# EAGLE design untitled-1.1 (EAGLE 9.6.2)
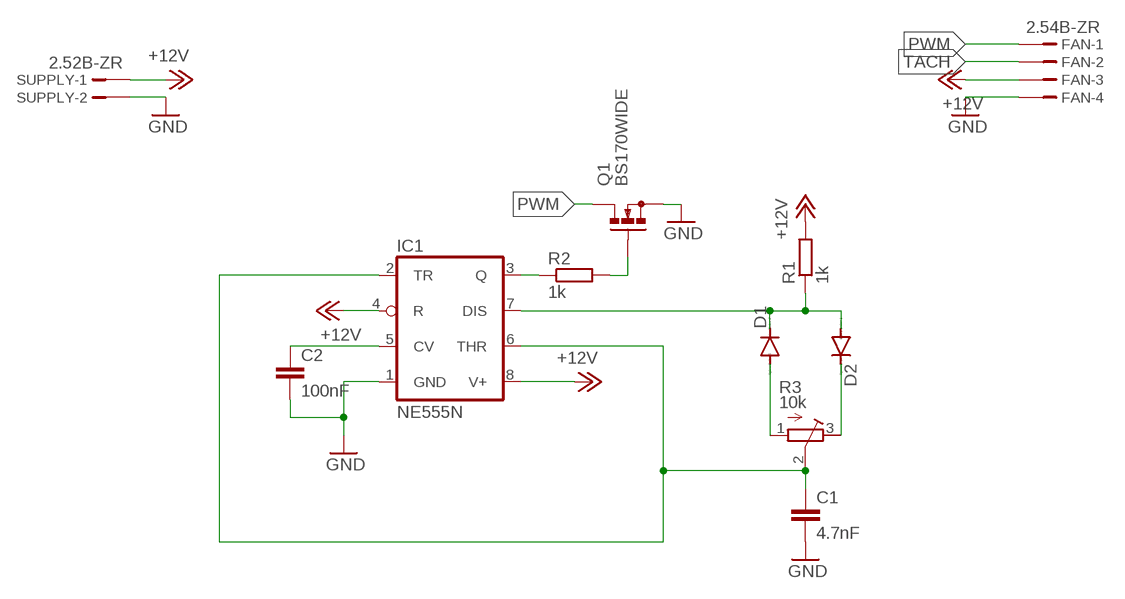
[diagram p0: schematic, sheet 1]

## Parts
C1  4.7nF  C-EU050-030X075  [C050-030X075]
C2  100nF  C-EU025-025X050  [C025-025X050]
D1  1N40045  [DO41-5]
D2  1N40045  [DO41-5]
FAN  2.54B-ZR  [B4B-ZR2.5]
IC1  NE555N  [DIL08]
Q1  BS170WIDE  [SOT54E2]
R1  1k  R-EU_0204/7  [0204/7]
R2  1k  R-EU_0204/7  [0204/7]
R3  10k  R-TRIMM3296W  [RTRIM3296W]
SUPPLY  2.52B-ZR  [B2B-ZR2.5]

## Nets
+12V: FAN.3 IC1.4(R) IC1.8(V+) R1.2 SUPPLY.1
CV: C2.1 IC1.5(CV)
DIS: D1.C D2.A IC1.7(DIS) R1.1
GND: C1.2 C2.2 FAN.4 IC1.1(GND) Q1.S SUPPLY.2
N$1: Q1.G R2.2
N$4: D1.A R3.1(A)
N$5: D2.C R3.3(E)
PWM: FAN.1 Q1.D
Q: IC1.3(Q) R2.1
TACH: FAN.2
TR: C1.1 IC1.2(TR) IC1.6(THR) R3.2(S)

## Library data of the parts
C1 C2 = rcl-custom:C-EU: CAPACITOR, European symbol; SPICEPREFIX: C
D1 D2 = diode-custom:1N4004: DIODE general purpose rectifier, 1 A
FAN = con-jst-custom:?4B-ZR: ZH CONNECTOR 1.5 mm, 4 pin 1 row Source: http://www.jst.com .. eZH.pdf
IC1 = linear:*555: TIMER
Q1 = samuel:BS170: N-CHANNEL MOS FET
R1 R2 = rcl-custom:R-EU_: RESISTOR, European symbol; SPICEPREFIX: R
R3 = rcl-custom:R-TRIMM: Trimm resistor; SPICEMODEL: X; SPICEPREFIXL: POT
SUPPLY = con-jst-custom:?2B-ZR: ZH CONNECTOR 1.5 mm, 4 pin 1 row Source: http://www.jst.com .. eZH.pdf

## Board
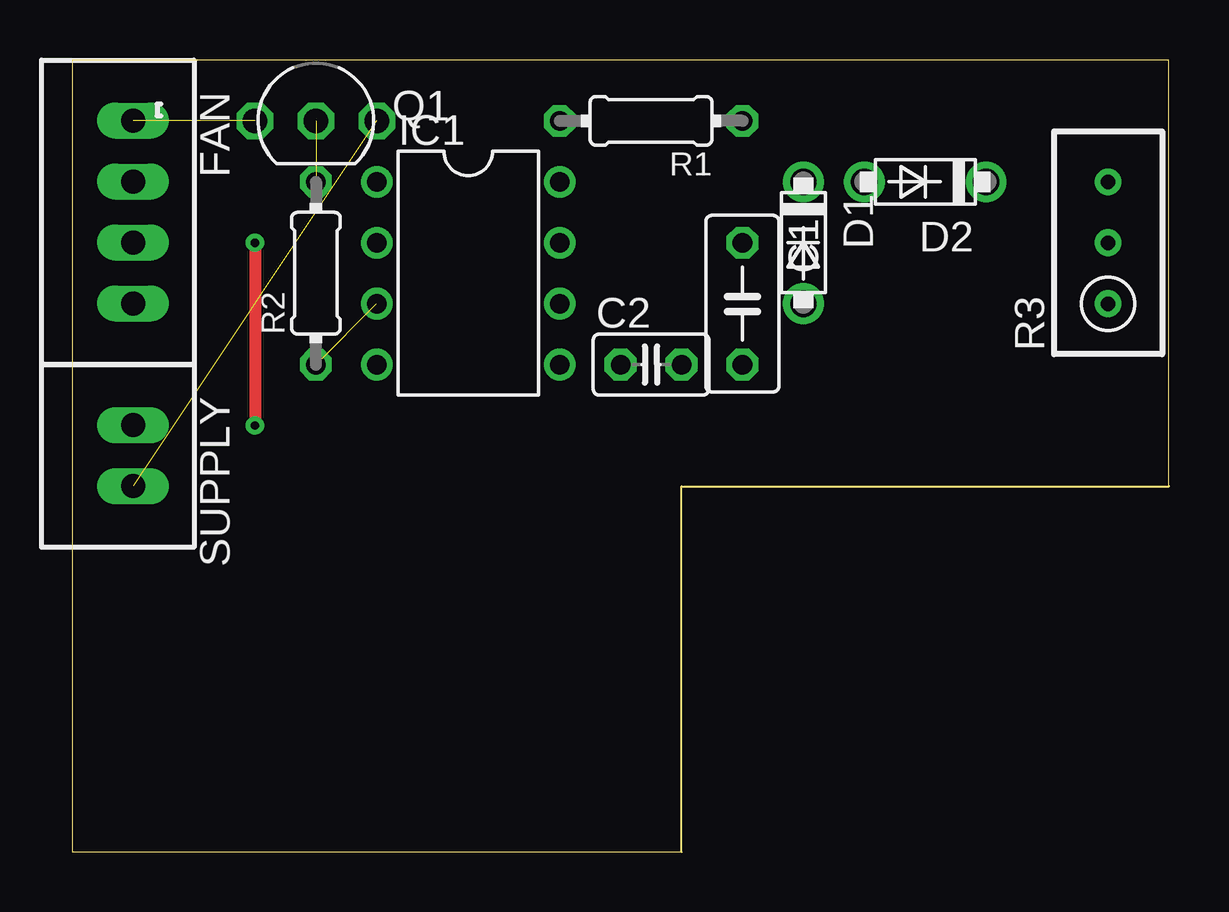
[diagram p1: board, top side]
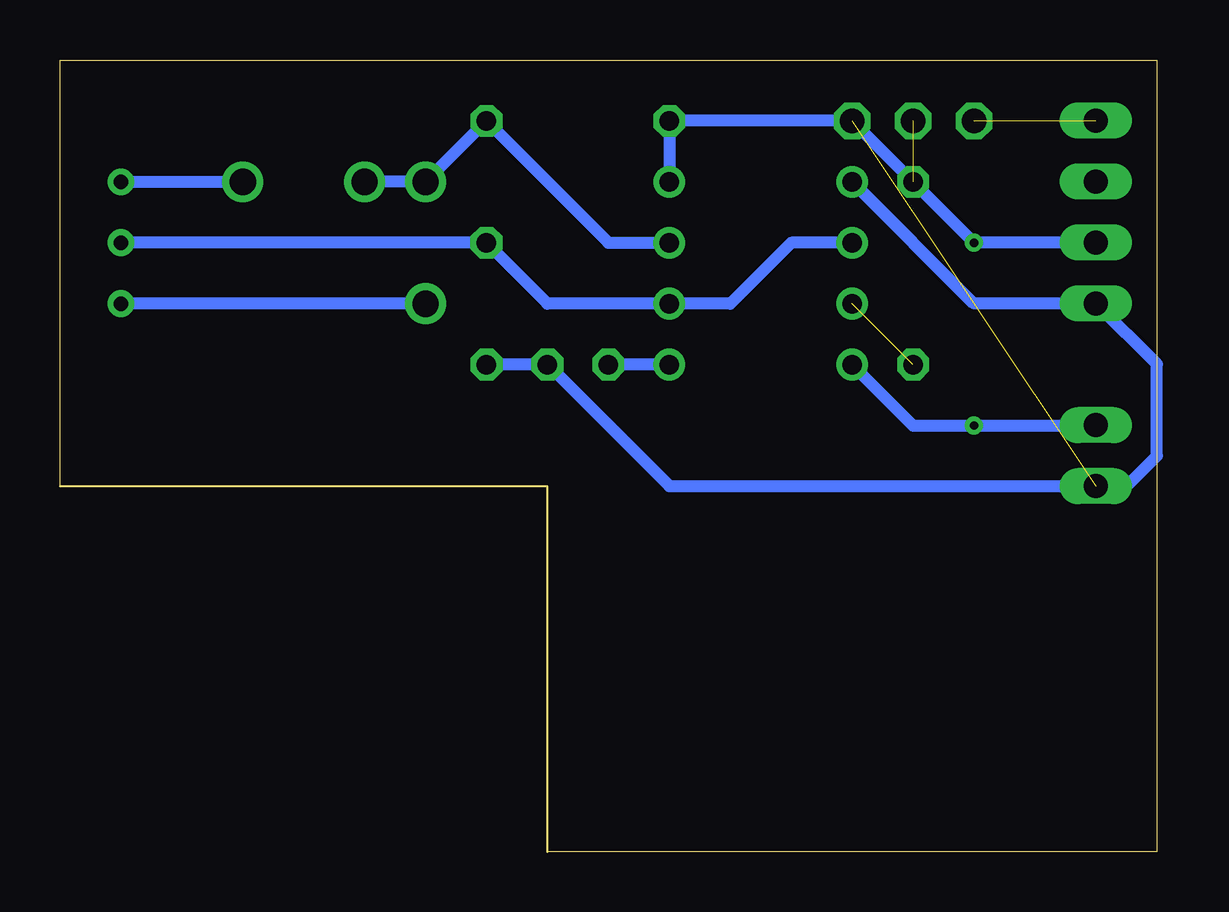
[diagram p2: board, bottom side, seen from below]

Size 45.72 x 33.02 mm. Coordinates in mm from the lower left corner, seen from the top.
Outline: 0,0 25.4,0 25.4,15.24 45.72,15.24 45.72,33.02 0,33.02 0,0
Copper layers (1*16): Top 0.035mm / dielectric 1.5mm / Bottom 0.035mm
Design rules "default": minimum track width 6mil, minimum drill 0.35mm, track to track 6mil, track to pad 6mil, pad to pad 6mil, via to via 6mil, smd to smd 6mil, copper to edge 40mil, drill to drill 6mil, minimum pad ring 10mil, minimum via ring 8mil, stop-mask expansion 4mil, vias tented up to drill 0mil, thermal gap 10mil

### Footprints (pad centres in the part's own frame; a part is rotated, then mirrored left to right if it is on the bottom)
C050-030X075 = drill 0.813 octagon: 1 -2.54,0; 2 2.54,0
C025-025X050 = drill 0.813 octagon: 1 -1.27,0; 2 1.27,0
DO41-5 = drill 1.1 pad 1.7: A 2.54,0; C -2.54,0
B4B-ZR2.5 = drill 1 pad 1.422 long: 1 -3.825,0; 2 -1.283,0; 3 1.257,0; 4 3.797,0
DIL08 = drill 0.813 pad 1.27: 1 -3.81,-3.81; 2 -1.27,-3.81; 3 1.27,-3.81; 4 3.81,-3.81; 5 3.81,3.81; 6 1.27,3.81; 7 -1.27,3.81; 8 -3.81,3.81
SOT54E2 = drill 1.016 octagon: D -2.54,0; G 0,0; S 2.54,0
0204/7 = drill 0.813 octagon: 1 -3.81,0; 2 3.81,0
RTRIM3296W = drill 0.61: 1 0,-2.54; 2 0,0; 3 0,2.54
B2B-ZR2.5 = drill 1 pad 1.422 long: 1 -1.285,0; 2 1.257,0

### Placement (x,y rotation side)
C1  27.94,22.86 270 top
C2  24.13,20.32 0 top
D1  30.48,25.4 270 top
D2  35.56,27.94 180 top
FAN  2.54,26.67 270 top
IC1  16.51,24.13 270 top
Q1  10.16,30.48 0 top
R1  24.13,30.48 180 top
R2  10.16,24.13 90 top
R3  43.18,25.4 0 top
SUPPLY  2.54,16.51 270 top

### Tracks (layer width: path | path; a pad name or v marks a point on that pad's centre or on a via)
+12V  (via drill 0.35)
  Top 0.508: v7.62,25.4 v7.62,17.78
  Bottom 0.508: SUPPLY.1 2.56,17.78 v7.62,17.78 10.16,17.78 IC1.4 | IC1.8 R1.2 12.7,30.48 v7.62,25.4 7.61,25.41 FAN.3
CV
  Bottom 0.508: IC1.5 C2.1
DIS
  Bottom 0.508: IC1.7 22.86,25.4 R1.1 D1.C D2.A
GND  (1 unrouted)
  Bottom 0.508: IC1.1 12.69,27.94 7.62,22.87 FAN.4 0,20.33 0,16.51 1.26,15.25 SUPPLY.2 20.32,15.25 25.39,20.32 C2.2 C1.2
N$1  (1 unrouted)
N$4
  Bottom 0.508: D1.A R3.1
N$5
  Bottom 0.508: R3.3 D2.C
PWM  (1 unrouted)
Q  (1 unrouted)
TR
  Bottom 0.508: IC1.2 15.24,25.4 17.78,22.86 IC1.6 25.4,22.86 C1.1 R3.2